# Altium schematic sheet 04_MISC.SchDoc
size A2; SheetNumber: 5; SheetTotal: 5
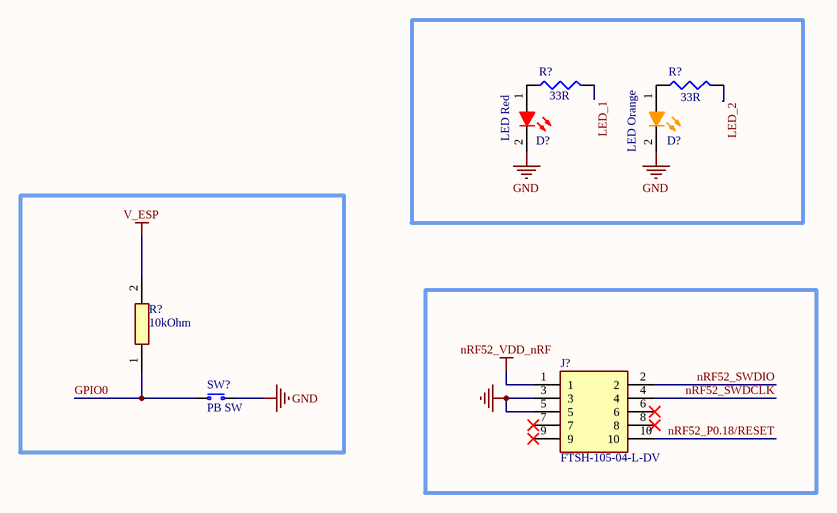
[diagram p0: 04_MISC.SchDoc]

## Parts
(Parts that share a designator on the sheet are numbered #1, #2 ... from top to bottom, then left to right.)
D?#1  LED Red  [DIOC1608X08L_2]
D?#2  LED Orange  [DIOC1608X08L_2]
J?  FTSH-105-04-L-DV  [FTSH-105-XX-YYY-DV]
R?#1  value 33R  [0402]
R?#2  value 33R  [0402]
R?#3  value 10kOhm  [RESC0603X28N]  (hidden comment: CRCW020110K0FKED)
SW?  PB SW  [C&K_PTS810]

## Nets
GND: D?#1.2(K) D?#2.2(K) J?.3 J?.5 SW?.1(N.O)
nRF52_VDD_nRF: J?.1
V_ESP: R?#3.2
GPIO0: R?#3.1 SW?.2(COM)
LED_1: R?#1.2
LED_2: R?#2.2
nRF52_P0.18/RESET: J?.10
nRF52_SWDCLK: J?.4
nRF52_SWDIO: J?.2
NetD?#1_1: D?#1.1(A) R?#1.1
NetD?#2_1: D?#2.1(A) R?#2.1

Not connected (* = marked no-connect by the designer): J? 6* 7* 8* 9*

## Library data of the parts
D?#1 = KING-LED-RED-APT1608LSECK/J3-PRV: 1.6X0.8mm SMD CHIP LED LAMP, Hyper Red; Part Number: APT1608LSECK/J4-PRV; Forward Voltage: 1.8V; Test Current: 2mA; ComponentLink1Description: Datasheet; ComponentLink1URL: http://www.kingbrightusa.com/images/catalog/SPEC/APT1608LSECK-J3-PRV.pdf; Supplier 1: Digi-Key; Supplier 2: Mouser; Supplier 3: Digi-Key; Supplier 4: Digi-Key; Supplier Part Number 1: 754-1930-6-ND; Supplier Part Number 2: 604-APT1608LSECKJ3RV; Supplier Part Number 3: 754-1930-1-ND; Supplier Part Number 4: 754-1930-2-ND
D?#2 = KING-LED-ORANGE-APT1608LSECK/J4-PRV: 1.6X0.8mm SMD CHIP LED LAMP, Super Bright Orange; Forward Voltage: 1.8V; Test Current: 2mA; Part Number: APT1608LSECK/J4-PRV; ComponentLink1Description: Datasheet; ComponentLink1URL: http://www.kingbrightusa.com/images/catalog/SPEC/APT1608LSECK-J4-PRV.pdf; Supplier 1: Digi-Key; Supplier 2: Digi-Key; Supplier 3: Mouser; Supplier 4: Digi-Key; Supplier Part Number 1: 754-1931-6-ND; Supplier Part Number 2: 754-1931-1-ND; Supplier Part Number 3: 604-APT1608LSECKJ4RV; Supplier Part Number 4: 754-1931-2-ND
J? = FTSH-105-04-L-DV: Connector; Manufacturer_Name: SAMTEC; Datasheet Link: http://suddendocs.samtec.com/prints/ftsh-1xx-xx-xxx-dv-xxx-xxx-mkt.pdf; Manufacturer_Part_Number: FTSH-105-04-L-DV; Mouser Part Number: 200-FTSH10504LDV; Mouser Price/Stock: https://www.mouser.co.uk/ProductDetail/Samtec/FTSH-105-04-L-DV?qs=0lQeLiL1qyYXTIglnPdEUw%3D%3D; Arrow Part Number: FTSH-105-04-L-DV; Arrow Price/Stock: https://www.arrow.com/en/products/ftsh-105-04-l-dv/samtec
R?#1 R?#2 = Res3: Resistor; Published: 8-Jun-2000; LatestRevisionDate: 29-May-2009; LatestRevisionNote: IPC-7351 Footprint Added.; PackageReference: J1-0603; Publisher: Altium Limited; PackageDescription: Chip Resistor
R?#3 = CRCW020110K0FKED: Resistor; Manufacturer_Name: Vishay; Datasheet Link: http://www.vishay.com/docs/20035/dcrcwe3.pdf; Height: 0.28mm; Manufacturer_Part_Number: CRCW020110K0FKED; Arrow Part Number: CRCW020110K0FKED; Arrow Price/Stock: https://www.arrow.com/en/products/crcw020110k0fked/vishay
SW? = PTS810 SJK 250 SMTR LFS: Tactile Switch, SPNO, SMD, 260gf, 4.2x3.2x2.5mm; Manufacturer: C&K; Part number IPS: 00000001259; Note: N.A.; Pad Count: 4; Part Number: PTS810 SJK 250 SMTR LFS; Manufacturer Part Number: PTS810 SJK 250 SMTR LFS; LatestRevisionDate: 2017-11-09; Published: 2017-09-18; Value: PB SW; Artikkelnr Noca: N.A.; Footprint Doc: PTS810; ComponentLink1Description: Datasheet; ComponentLink1URL: N.A.; ComponentLink2Description: Supplier link; ComponentLink2URL: N.A.; HelpURL: http://www.ckswitches.com/media/1476/pts810.pdf; Supplier 1: Digi-Key; Supplier Part Number 1: CKN10503TR-ND; Supplier 2: N.A.; Supplier Part Number 2: N.A.; PartId: 101500104; Component Class: Switches; Author: rsk; Part number Norautron: N.A.